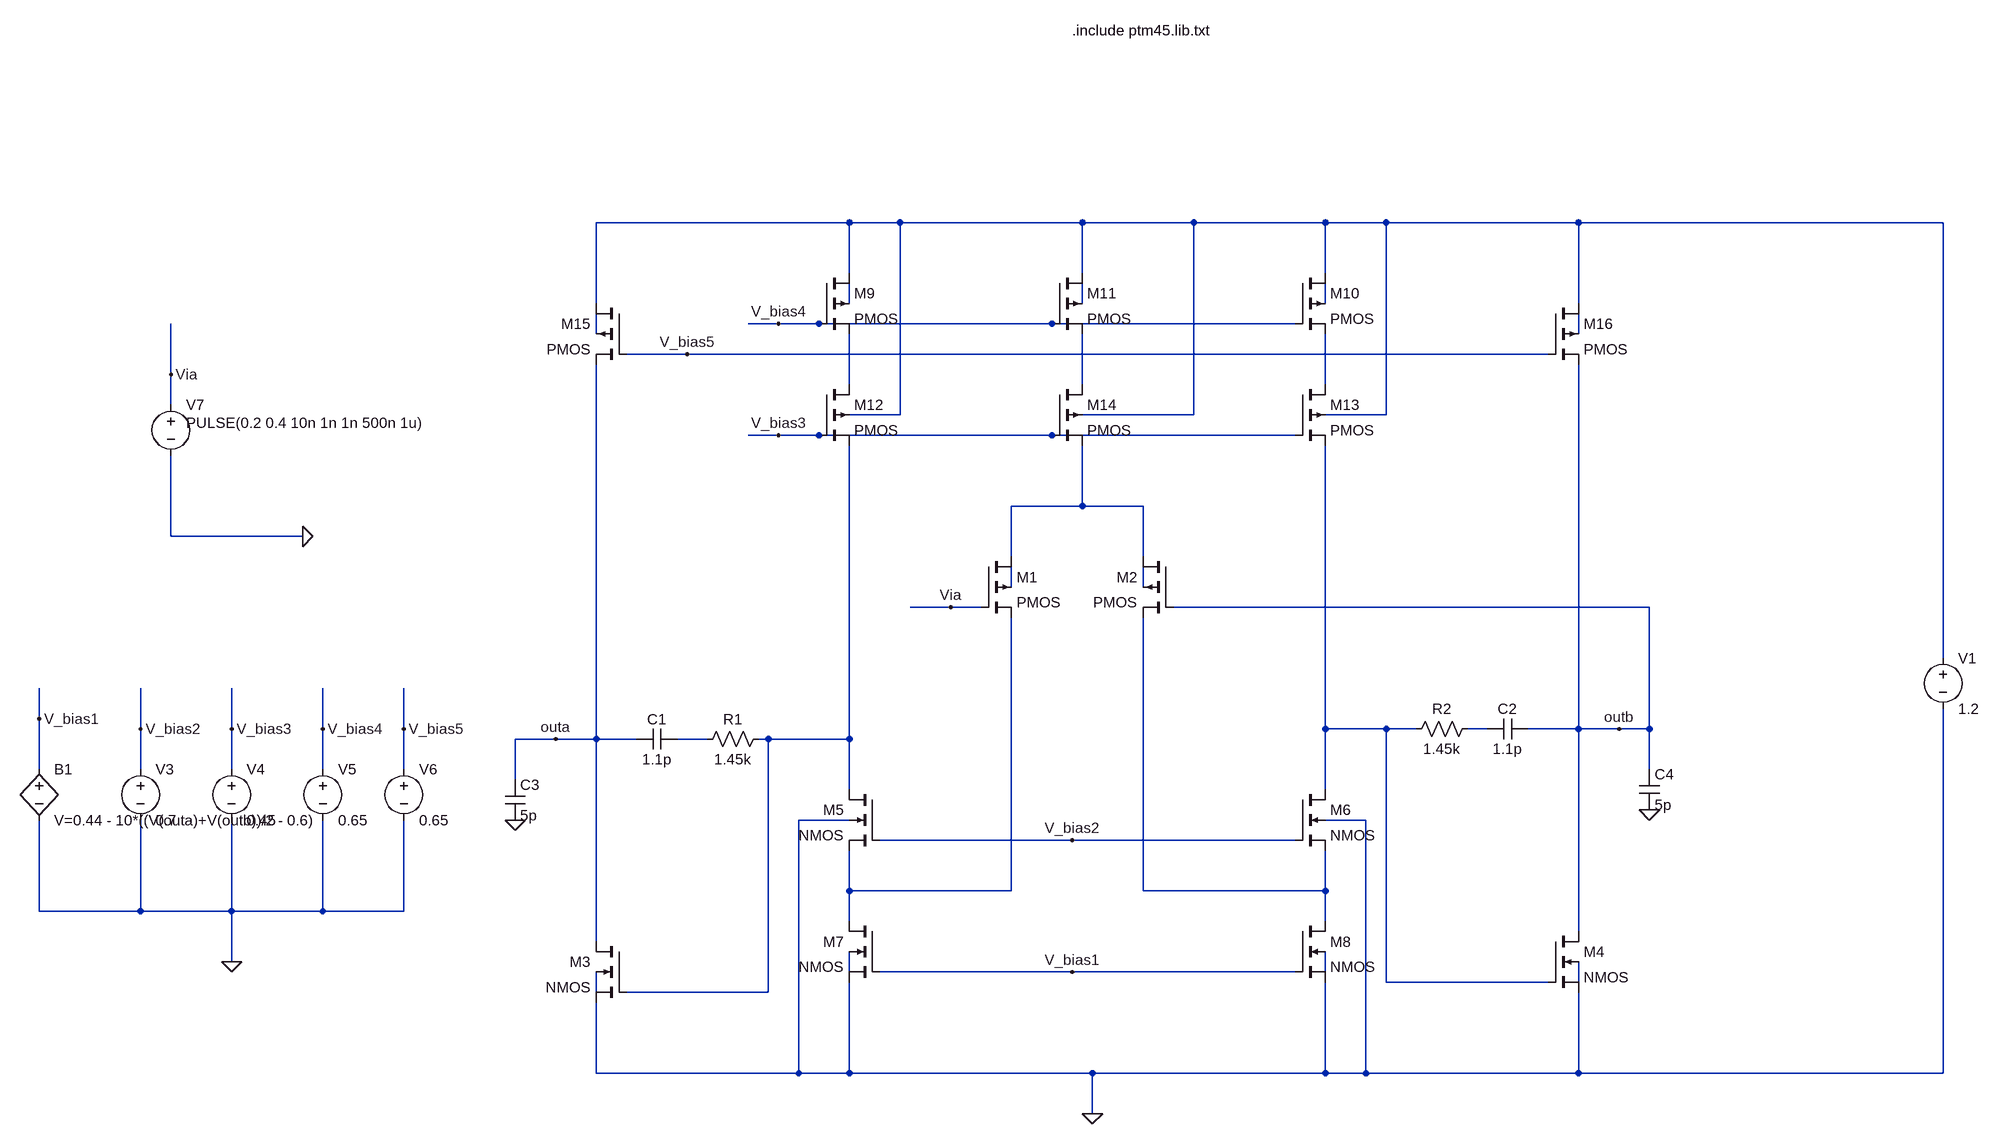
[diagram p0: schematic OTA.asc]
OTA.asc, the LTspice schematic file:
Version 4
SHEET 1 1776 1108
WIRE -16 -320 -416 -320
WIRE 64 -320 -16 -320
WIRE 352 -320 64 -320
WIRE 528 -320 352 -320
WIRE 736 -320 528 -320
WIRE 832 -320 736 -320
WIRE 1136 -320 832 -320
WIRE 1712 -320 1136 -320
WIRE -16 -240 -16 -320
WIRE 352 -240 352 -320
WIRE 736 -240 736 -320
WIRE -416 -192 -416 -320
WIRE -16 -192 -16 -224
WIRE 352 -192 352 -224
WIRE 736 -192 736 -224
WIRE 1136 -192 1136 -320
WIRE -128 -160 -176 -160
WIRE -64 -160 -128 -160
WIRE 304 -160 -64 -160
WIRE 688 -160 304 -160
WIRE -416 -144 -416 -176
WIRE 1136 -144 1136 -176
WIRE -272 -112 -368 -112
WIRE 1088 -112 -272 -112
WIRE -1088 -80 -1088 -160
WIRE -16 -64 -16 -144
WIRE 352 -64 352 -144
WIRE 736 -64 736 -144
WIRE -1088 -32 -1088 -80
WIRE 64 -16 64 -320
WIRE 64 -16 -16 -16
WIRE 528 -16 528 -320
WIRE 528 -16 352 -16
WIRE 832 -16 832 -320
WIRE 832 -16 736 -16
WIRE -128 16 -176 16
WIRE -64 16 -128 16
WIRE 304 16 -64 16
WIRE 688 16 304 16
WIRE 352 128 352 32
WIRE 352 128 240 128
WIRE 448 128 352 128
WIRE -1088 176 -1088 48
WIRE -880 176 -1088 176
WIRE 240 208 240 128
WIRE 448 208 448 128
WIRE 240 256 240 224
WIRE 448 256 448 224
WIRE 144 288 80 288
WIRE 192 288 144 288
WIRE 1248 288 496 288
WIRE 1712 368 1712 -320
WIRE -1296 464 -1296 416
WIRE -1136 480 -1136 416
WIRE -992 480 -992 416
WIRE -848 480 -848 416
WIRE -720 480 -720 416
WIRE 736 480 736 32
WIRE 832 480 736 480
WIRE 880 480 832 480
WIRE 992 480 960 480
WIRE 1136 480 1136 -96
WIRE 1136 480 1056 480
WIRE 1200 480 1136 480
WIRE 1248 480 1248 288
WIRE 1248 480 1200 480
WIRE -480 496 -544 496
WIRE -416 496 -416 -96
WIRE -416 496 -480 496
WIRE -352 496 -416 496
WIRE -240 496 -288 496
WIRE -144 496 -160 496
WIRE -16 496 -16 32
WIRE -16 496 -144 496
WIRE -1296 544 -1296 464
WIRE -1136 544 -1136 480
WIRE -992 544 -992 480
WIRE -848 544 -848 480
WIRE -720 544 -720 480
WIRE 1248 544 1248 480
WIRE -544 560 -544 496
WIRE -16 576 -16 496
WIRE 736 576 736 480
WIRE -16 624 -96 624
WIRE 800 624 736 624
WIRE 336 656 32 656
WIRE 688 656 336 656
WIRE -16 736 -16 672
WIRE 240 736 240 304
WIRE 240 736 -16 736
WIRE 448 736 448 304
WIRE 736 736 736 672
WIRE 736 736 448 736
WIRE -1296 768 -1296 624
WIRE -1136 768 -1136 624
WIRE -1136 768 -1296 768
WIRE -992 768 -992 624
WIRE -992 768 -1136 768
WIRE -848 768 -848 624
WIRE -848 768 -992 768
WIRE -720 768 -720 624
WIRE -720 768 -848 768
WIRE -16 784 -16 736
WIRE 736 784 736 736
WIRE 1136 800 1136 480
WIRE -416 816 -416 496
WIRE -992 848 -992 768
WIRE -16 864 -16 832
WIRE 336 864 32 864
WIRE 688 864 336 864
WIRE 736 864 736 832
WIRE 832 880 832 480
WIRE 1088 880 832 880
WIRE 1136 880 1136 848
WIRE -416 896 -416 864
WIRE -144 896 -144 496
WIRE -144 896 -368 896
WIRE -416 1024 -416 912
WIRE -96 1024 -96 624
WIRE -96 1024 -416 1024
WIRE -16 1024 -16 880
WIRE -16 1024 -96 1024
WIRE 368 1024 -16 1024
WIRE 736 1024 736 880
WIRE 736 1024 368 1024
WIRE 800 1024 800 624
WIRE 800 1024 736 1024
WIRE 1136 1024 1136 896
WIRE 1136 1024 800 1024
WIRE 1712 1024 1712 448
WIRE 1712 1024 1136 1024
WIRE 368 1088 368 1024
FLAG 368 1088 0
FLAG 336 864 V_bias1
FLAG 336 656 V_bias2
FLAG -128 16 V_bias3
FLAG -128 -160 V_bias4
FLAG -272 -112 V_bias5
FLAG 144 288 Via
FLAG -1296 464 V_bias1
FLAG -1136 480 V_bias2
FLAG -992 480 V_bias3
FLAG -848 480 V_bias4
FLAG -720 480 V_bias5
FLAG -992 848 0
FLAG -880 176 0
FLAG -1088 -80 Via
FLAG 1248 608 0
FLAG -544 624 0
FLAG -480 496 outa
FLAG 1200 480 outb
SYMBOL pmos4 192 208 R0
SYMATTR InstName M1
SYMATTR Value2 l=200n w=2u
SYMBOL pmos4 496 208 M0
SYMATTR InstName M2
SYMATTR Value2 l=200n w=2u
SYMBOL nmos4 -368 816 M0
SYMATTR InstName M3
SYMATTR Value2 l=200n w=2u m=5
SYMBOL nmos4 1088 800 R0
SYMATTR InstName M4
SYMATTR Value2 l=200n w=2u m=5
SYMBOL nmos4 32 576 M0
SYMATTR InstName M5
SYMATTR Value2 l=200n w=2u
SYMBOL nmos4 688 576 R0
SYMATTR InstName M6
SYMATTR Value2 l=200n w=2u
SYMBOL nmos4 32 784 M0
SYMATTR InstName M7
SYMATTR Value2 l=200n w=2u m=2
SYMBOL nmos4 688 784 R0
SYMATTR InstName M8
SYMATTR Value2 l=200n w=2u m=2
SYMBOL pmos4 -64 -240 R0
SYMATTR InstName M9
SYMATTR Value2 l=200n w=2u
SYMBOL pmos4 688 -240 R0
SYMATTR InstName M10
SYMATTR Value2 l=200n w=2u
SYMBOL pmos4 304 -240 R0
SYMATTR InstName M11
SYMATTR Value2 l=200n w=2u m=2
SYMBOL pmos4 -64 -64 R0
SYMATTR InstName M12
SYMATTR Value2 l=200n w=2u
SYMBOL pmos4 688 -64 R0
SYMATTR InstName M13
SYMATTR Value2 l=200n w=2u
SYMBOL pmos4 304 -64 R0
SYMATTR InstName M14
SYMATTR Value2 l=200n w=2u m=2
SYMBOL pmos4 -368 -192 M0
SYMATTR InstName M15
SYMATTR Value2 l=200n w=2u m=5
SYMBOL pmos4 1088 -192 R0
SYMATTR InstName M16
SYMATTR Value2 l=200n w=2u m=5
SYMBOL cap -352 512 R270
WINDOW 0 32 32 VTop 2
WINDOW 3 0 32 VBottom 2
SYMATTR InstName C1
SYMATTR Value 1.1p
SYMBOL cap 992 496 R270
WINDOW 0 32 32 VTop 2
WINDOW 3 0 32 VBottom 2
SYMATTR InstName C2
SYMATTR Value 1.1p
SYMBOL res -144 480 R90
WINDOW 0 0 56 VBottom 2
WINDOW 3 32 56 VTop 2
SYMATTR InstName R1
SYMATTR Value 1.45k
SYMBOL res 976 464 R90
WINDOW 0 0 56 VBottom 2
WINDOW 3 32 56 VTop 2
SYMATTR InstName R2
SYMATTR Value 1.45k
SYMBOL voltage 1712 352 R0
WINDOW 123 0 0 Left 0
WINDOW 39 0 0 Left 0
SYMATTR InstName V1
SYMATTR Value 1.2
SYMBOL voltage -1136 528 R0
WINDOW 123 0 0 Left 0
WINDOW 39 0 0 Left 0
SYMATTR InstName V3
SYMATTR Value 0.7
SYMBOL voltage -992 528 R0
WINDOW 123 0 0 Left 0
WINDOW 39 0 0 Left 0
SYMATTR InstName V4
SYMATTR Value 0.45
SYMBOL voltage -848 528 R0
WINDOW 123 0 0 Left 0
WINDOW 39 0 0 Left 0
SYMATTR InstName V5
SYMATTR Value 0.65
SYMBOL voltage -720 528 R0
WINDOW 123 0 0 Left 0
WINDOW 39 0 0 Left 0
SYMATTR InstName V6
SYMATTR Value 0.65
SYMBOL voltage -1088 -48 R0
WINDOW 3 24 44 Left 2
WINDOW 123 24 124 Left 2
WINDOW 39 0 0 Left 0
SYMATTR InstName V7
SYMATTR Value PULSE(0.2 0.4 10n 1n 1n 500n 1u)
SYMBOL cap -560 560 R0
SYMATTR InstName C3
SYMATTR Value 5p
SYMBOL cap 1232 544 R0
SYMATTR InstName C4
SYMATTR Value 5p
SYMBOL bv -1296 528 R0
SYMATTR InstName B1
SYMATTR Value V=0.44 - 10*((V(outa)+V(outb))/2 - 0.6)
TEXT 336 -624 Left 2 !.include ptm45.lib.txt

The netlist it stands for:
* OTA.asc
M1 N010 Via N017 N011 PMOS l=200n w=2u
M2 N010 outb N018 N012 PMOS l=200n w=2u
M3 outa N016 0 N022 NMOS l=200n w=2u m=5
M4 outb N013 0 N021 NMOS l=200n w=2u m=5
M5 N016 V_bias2 N017 0 NMOS l=200n w=2u
M6 N013 V_bias2 N018 0 NMOS l=200n w=2u
M7 N017 V_bias1 0 N019 NMOS l=200n w=2u m=2
M8 N018 V_bias1 0 N020 NMOS l=200n w=2u m=2
M9 N001 V_bias4 N007 N002 PMOS l=200n w=2u
M10 N001 V_bias4 N009 N004 PMOS l=200n w=2u
M11 N001 V_bias4 N008 N003 PMOS l=200n w=2u m=2
M12 N007 V_bias3 N016 N001 PMOS l=200n w=2u
M13 N009 V_bias3 N013 N001 PMOS l=200n w=2u
M14 N008 V_bias3 N010 N001 PMOS l=200n w=2u m=2
M15 N001 V_bias5 outa N005 PMOS l=200n w=2u m=5
M16 N001 V_bias5 outb N006 PMOS l=200n w=2u m=5
C1 outa N015 1.1p
C2 N014 outb 1.1p
R1 N016 N015 1.45k
R2 N014 N013 1.45k
V1 N001 0 1.2
V3 V_bias2 0 0.7
V4 V_bias3 0 0.45
V5 V_bias4 0 0.65
V6 V_bias5 0 0.65
V7 Via 0 PULSE(0.2 0.4 10n 1n 1n 500n 1u)
C3 outa 0 5p
C4 outb 0 5p
B1 V_bias1 0 V=0.44 - 10*((V(outa)+V(outb))/2 - 0.6)
.model NMOS NMOS
.model PMOS PMOS
.lib standard.mos
.include ptm45.lib.txt
.backanno
.end